# EAGLE design PCB1 (EAGLE 9.6.2)
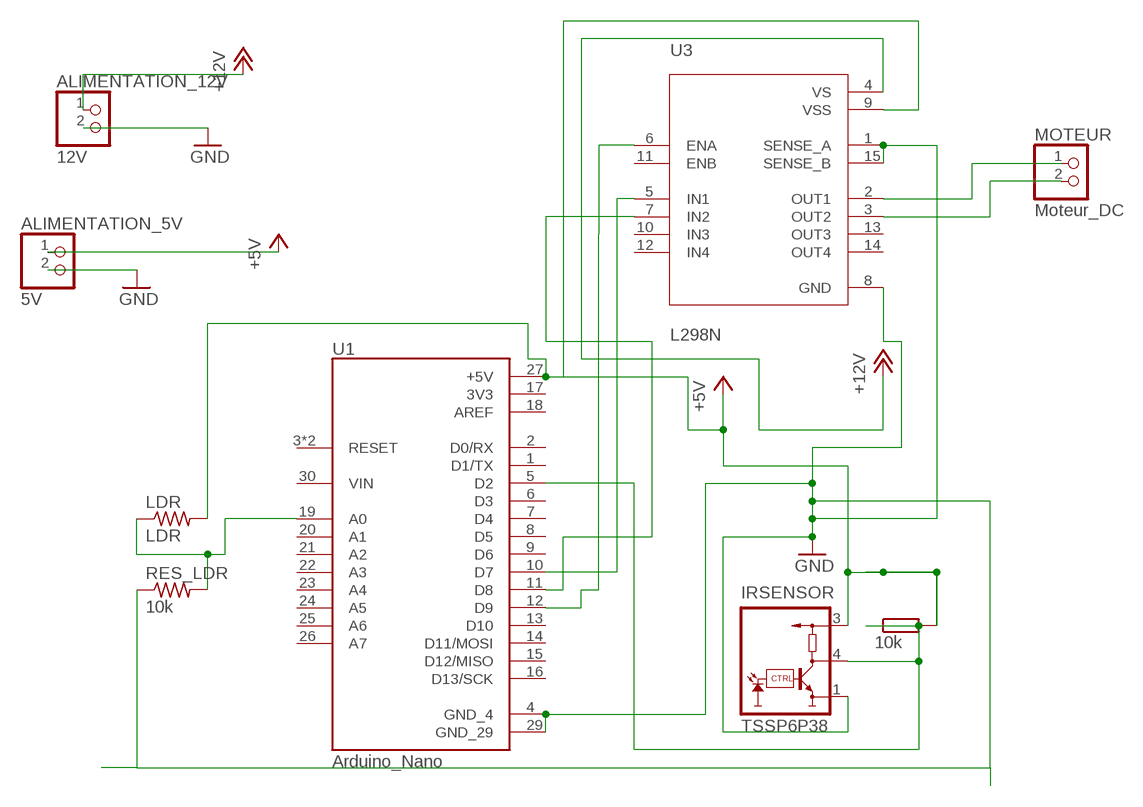
[diagram p0: schematic, sheet 1]

## Parts
ALIMENTATION_5V  5V  PINHD-1X2  [1X02]
ALIMENTATION_12V  12V  PINHD-1X2  [1X02]
IRSENSOR  TSSP6P38  [TSSP6P38]
LDR  LDR  R-US_WSC01/2  [WSC01/2]
MOTEUR  Moteur_DC  PINHD-1X2  [1X02]
R_PULL_UP  10k  R-EU_0204/2V  [0204V]
RES_LDR  10k  R-US_0204/5  [0204/5]
U1  Arduino_Nano  ARDUINO_NANO  [MODULE_ARDUINO_NANO]
U3  L298N  [TO127P2020X500X2100-15]

## Nets
+5V: ALIMENTATION_5V.1 IRSENSOR.3(VS) LDR.2 R_PULL_UP.2 U1.27(+5V) U3.9(VSS)
+12V: ALIMENTATION_12V.1 U3.4(VS)
GND: ALIMENTATION_5V.2 ALIMENTATION_12V.2 IRSENSOR.1(GND) RES_LDR.1 U1.4(GND_4) U1.29(GND_29) U3.1(SENSE_A) U3.8(GND) U3.15(SENSE_B)
IR_OUT: IRSENSOR.4(OUT) R_PULL_UP.1 U1.5(D2)
L298_ENA: U1.12(D9) U3.6(ENA)
L298_IN1: U1.10(D7) U3.5(IN1)
L298_IN2: U1.11(D8) U3.7(IN2)
LDR_SIGNAL: LDR.1 RES_LDR.2 U1.19(A0)
MOTOR_OUT1: MOTEUR.1 U3.2(OUT1)
MOTOR_OUT2: MOTEUR.2 U3.3(OUT2)
Unconnected: U1.1(D1/TX) U1.2(D0/RX) U1.3(RESET) U1.6(D3) U1.7(D4) U1.8(D5) U1.9(D6) U1.13(D10) U1.14(D11/MOSI) U1.15(D12/MISO) U1.16(D13/SCK) U1.17(3V3) U1.18(AREF) U1.20(A1) U1.21(A2) U1.22(A3) U1.23(A4) U1.24(A5) U1.25(A6) U1.26(A7) U1.28(RESET) U1.30(VIN) U3.10(IN3) U3.11(ENB) U3.12(IN4) U3.13(OUT3) U3.14(OUT4)

## Library data of the parts
ALIMENTATION_5V ALIMENTATION_12V MOTEUR = pinhead:PINHD-1X2: PIN HEADER
IRSENSOR = opto-vishay:TSSP6P38: IR Mid Range Proximity Sensor Used source: IR Sensor transmitter and receiver diode.pdf Source to corrupt Data sheet <http://www.vishay.com/docs/82475/tssp6p38.pdf>
LDR RES_LDR = rcl:R-US_: RESISTOR, American symbol; SPICEPREFIX: R
R_PULL_UP = rcl:R-EU_: RESISTOR, European symbol; SPICEPREFIX: R
U1 = ARDUINO_NANO:ARDUINO_NANO: Check availability <https://pricing.snapeda.com/parts/Arduino%20Nano/Arduino/view-part?ref=eda>; AVAILABILITY: In Stock; CHECK_PRICES: https://www.snapeda.com/parts/Arduino%20Nano/Arduino/view-part/?ref=eda; DESCRIPTION: Small, complete, and breadboard-friendly board based on the ATmega328 (Arduino Nano 3.x); MF: Arduino; MP: Arduino Nano; PACKAGE: Non-Standard Arduino; PRICE: None; SNAPEDA_LINK: https://www.snapeda.com/parts/Arduino%20Nano/Arduino/view-part/?ref=snap
U3 = L298N:L298N; CHECK_PRICES: https://www.snapeda.com/parts/L298N/STMicroelectronics/view-part/?ref=eda; DESCRIPTION: Half Bridge (4) Driver DC Motors, Relays, Solenoids, Stepper Motors Bipolar 15-Multiwatt; DIGIKEY_PART_NUMBER: 497-1395-5-ND; MF: STMicroelectronics; MP: L298N; PACKAGE: Multiwatt-15 STMicroelectronics; SNAPEDA_LINK: https://www.snapeda.com/parts/L298N/STMicroelectronics/view-part/?ref=snap

## Board
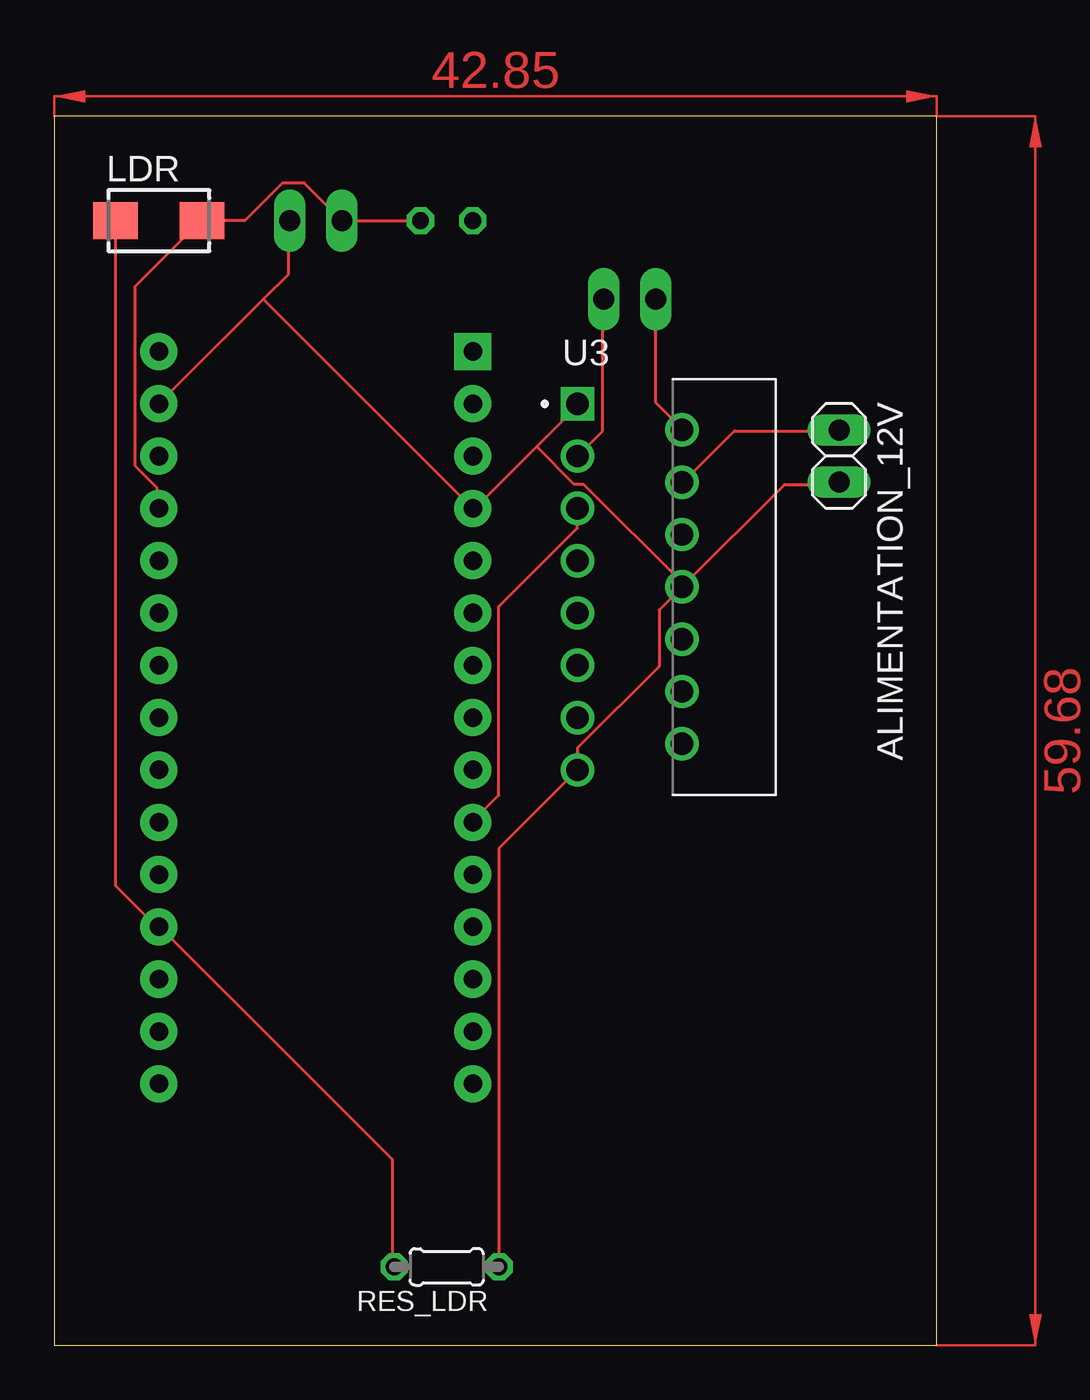
[diagram p1: board, top side]
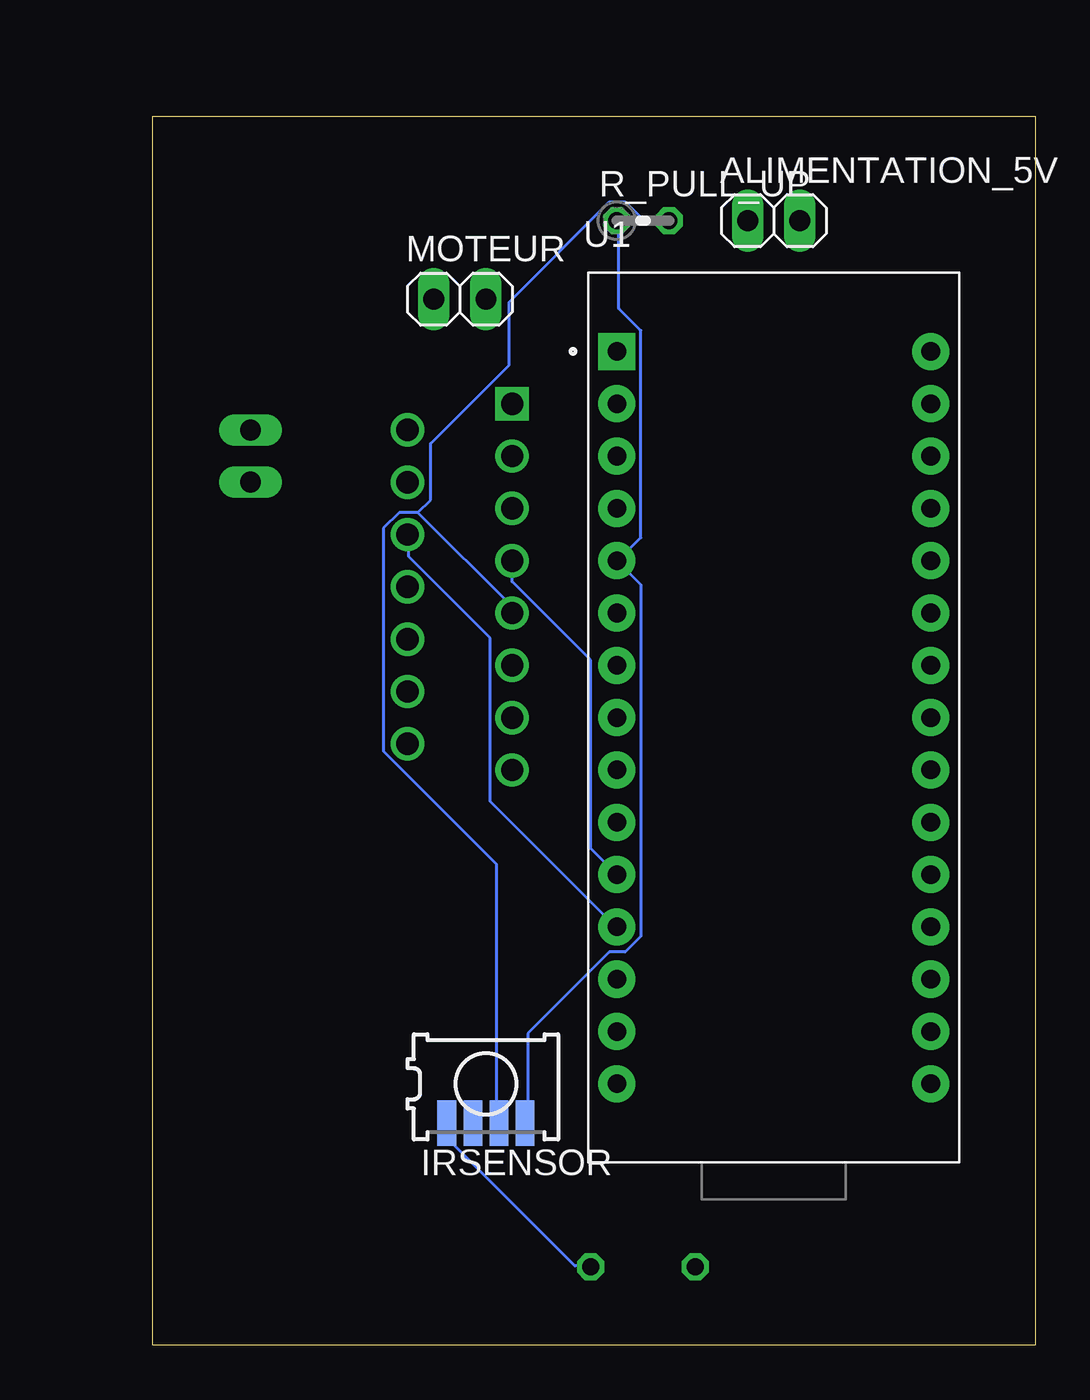
[diagram p2: board, bottom side, seen from below]

Size 42.85 x 59.68 mm. Coordinates in mm from the lower left corner, seen from the top.
Outline: 0,0 42.85,0 42.85,59.68 0,59.68 0,0
Copper layers (1*16): Top 0.035mm / dielectric 1.5mm / Bottom 0.035mm
Design rules "default": minimum track width 6mil, minimum drill 0.35mm, track to track 6mil, track to pad 6mil, pad to pad 6mil, via to via 6mil, smd to smd 6mil, copper to edge 40mil, drill to drill 6mil, minimum pad ring 10mil, minimum via ring 8mil, stop-mask expansion 4mil, vias tented up to drill 0mil, thermal gap 10mil

### Footprints (pad centres in the part's own frame; a part is rotated, then mirrored left to right if it is on the bottom)
1X02 = drill 1.016 long: 1 -1.27,0; 2 1.27,0
TSSP6P38 = smd 0.9 x 2.2: 1 -1.905,-1.905; 2 -0.635,-1.905; 3 0.635,-1.905; 4 1.905,-1.905
WSC01/2 = smd 2.16 x 1.78: 1 -2.1,0; 2 2.1,0
0204V = drill 0.813 octagon: 1 -1.27,0; 2 1.27,0
0204/5 = drill 0.813 octagon: 1 -2.54,0; 2 2.54,0
MODULE_ARDUINO_NANO = drill 0.9 pad 1.8 square: 1 -7.62,17.78 | drill 0.9 pad 1.8: 2 -7.62,15.24; 3 -7.62,12.7; 4 -7.62,10.16; 5 -7.62,7.62; 6 -7.62,5.08; 7 -7.62,2.54; 8 -7.62,0; 9 -7.62,-2.54; 10 -7.62,-5.08; 11 -7.62,-7.62; 12 -7.62,-10.16; 13 -7.62,-12.7; 14 -7.62,-15.24; 15 -7.62,-17.78; 16 7.62,-17.78; 17 7.62,-15.24; 18 7.62,-12.7; 19 7.62,-10.16; 20 7.62,-7.62; 21 7.62,-5.08; 22 7.62,-2.54; 23 7.62,0; 24 7.62,2.54; 25 7.62,5.08; 26 7.62,7.62; 27 7.62,10.16; 28 7.62,12.7; 29 7.62,15.24; 30 7.62,17.78
TO127P2020X500X2100-15 = drill 1.08 pad 1.62 square: 1 0,0 | drill 1.08 pad 1.62: 2 5.08,-1.27; 3 0,-2.54; 4 5.08,-3.81; 5 0,-5.08; 6 5.08,-6.35; 7 0,-7.62; 8 5.08,-8.89; 9 0,-10.16; 10 5.08,-11.43; 11 0,-12.7; 12 5.08,-13.97; 13 0,-15.24; 14 5.08,-16.51; 15 0,-17.78

### Placement (x,y rotation side)
ALIMENTATION_5V  12.7,54.61 0 bottom
ALIMENTATION_12V  38.1,43.18 270 top
IRSENSOR  26.67,12.7 0 bottom
LDR  5.08,54.61 0 top
MOTEUR  27.94,50.8 0 bottom
R_PULL_UP  19.05,54.61 0 bottom
RES_LDR  19.05,3.81 180 top
U1  12.7,30.48 0 bottom
U3  25.4,45.72 0 top

### Tracks (layer width: path | path; a pad name or v marks a point on that pad's centre or on a via)
+5V
  Top 0.152: R_PULL_UP.2 ALIMENTATION_5V.1 12.14,56.44 11.07,56.44 9.25,54.61 LDR.2 7.11,54.61 3.91,51.41 3.91,42.72 4.98,41.66 4.98,40.74 U1.27
  Bottom 0.152: 29.97,40.44 30.89,40.44 31.65,39.67 31.65,28.85 26.16,23.37 26.16,10.87 IRSENSOR.3 | 29.97,40.44 25.4,35.87 U3.9 | R_PULL_UP.2 19,54.61 19.91,55.52 20.68,55.52 25.55,50.65 25.55,47.6 29.36,43.79 29.36,41.05 29.97,40.44
+12V
  Top 0.152: ALIMENTATION_12V.1 38.05,44.4 33.02,44.4 30.58,41.96 U3.4
GND
  Top 0.152: U1.29 10.16,50.8 | 10.16,50.8 11.38,52.02 11.38,54.61 ALIMENTATION_5V.2 | 23.42,43.64 20.37,40.59 U1.4 10.16,50.8 | 23.42,43.64 25.4,45.62 U3.1 | 30.58,36.93 35.46,41.81 38.05,41.81 ALIMENTATION_12V.2 | 23.42,43.64 25.25,41.81 25.71,41.81 30.58,36.93 | 30.58,36.93 U3.8 29.36,35.71 29.36,32.97 25.4,29.01 U3.15 21.59,24.13 RES_LDR.1
  Bottom 0.152: IRSENSOR.1 28.45,10.72 28.45,9.96 22.35,3.86 21.59,3.86 RES_LDR.1
IR_OUT
  Bottom 0.152: IRSENSOR.4 24.64,10.87 24.64,15.14 20.68,19.1 19.91,19.1 19.15,19.86 19.15,36.93 U1.5 20.22,38.15 19.15,39.22 19.15,49.28 20.22,50.34 20.22,54.61 R_PULL_UP.1
L298_ENA
  Bottom 0.152: U3.6 30.43,39.37 30.43,38.3 26.47,34.34 26.47,26.42 20.37,20.32 U1.12
L298_IN1
  Top 0.152: U3.5 25.4,39.67 21.59,35.87 21.59,26.72 20.37,25.5 U1.10
L298_IN2
  Bottom 0.152: U3.7 25.4,37.08 21.59,33.27 21.59,24.13 U1.11
LDR_SIGNAL
  Top 0.152: LDR.1 3,54.61 3,22.3 4.98,20.32 U1.19 5.13,20.32 16.41,9.04 16.41,3.86 RES_LDR.2
MOTOR_OUT1
  Top 0.152: MOTEUR.1 29.21,45.77 30.43,44.55 U3.2
MOTOR_OUT2
  Top 0.152: U3.3 26.62,44.4 26.62,50.8 MOTEUR.2
(copper drawn outside any net)
  shapes: Top area x2